# EasyEDA Pro project ProPrj_New Project_2026-07-15_23-14-34_2026-07-27.epro, schematic Schematic2
Board Name: Board1; Create Date: 2026-07-15; Page Name: P1; Project Name: New Project_2026-07-15_23-14-34; Schematic Name: Schematic1; Update Date: 2026-07-15; Company: EasyEDA.com; Page Size: A4; Version: V1.0
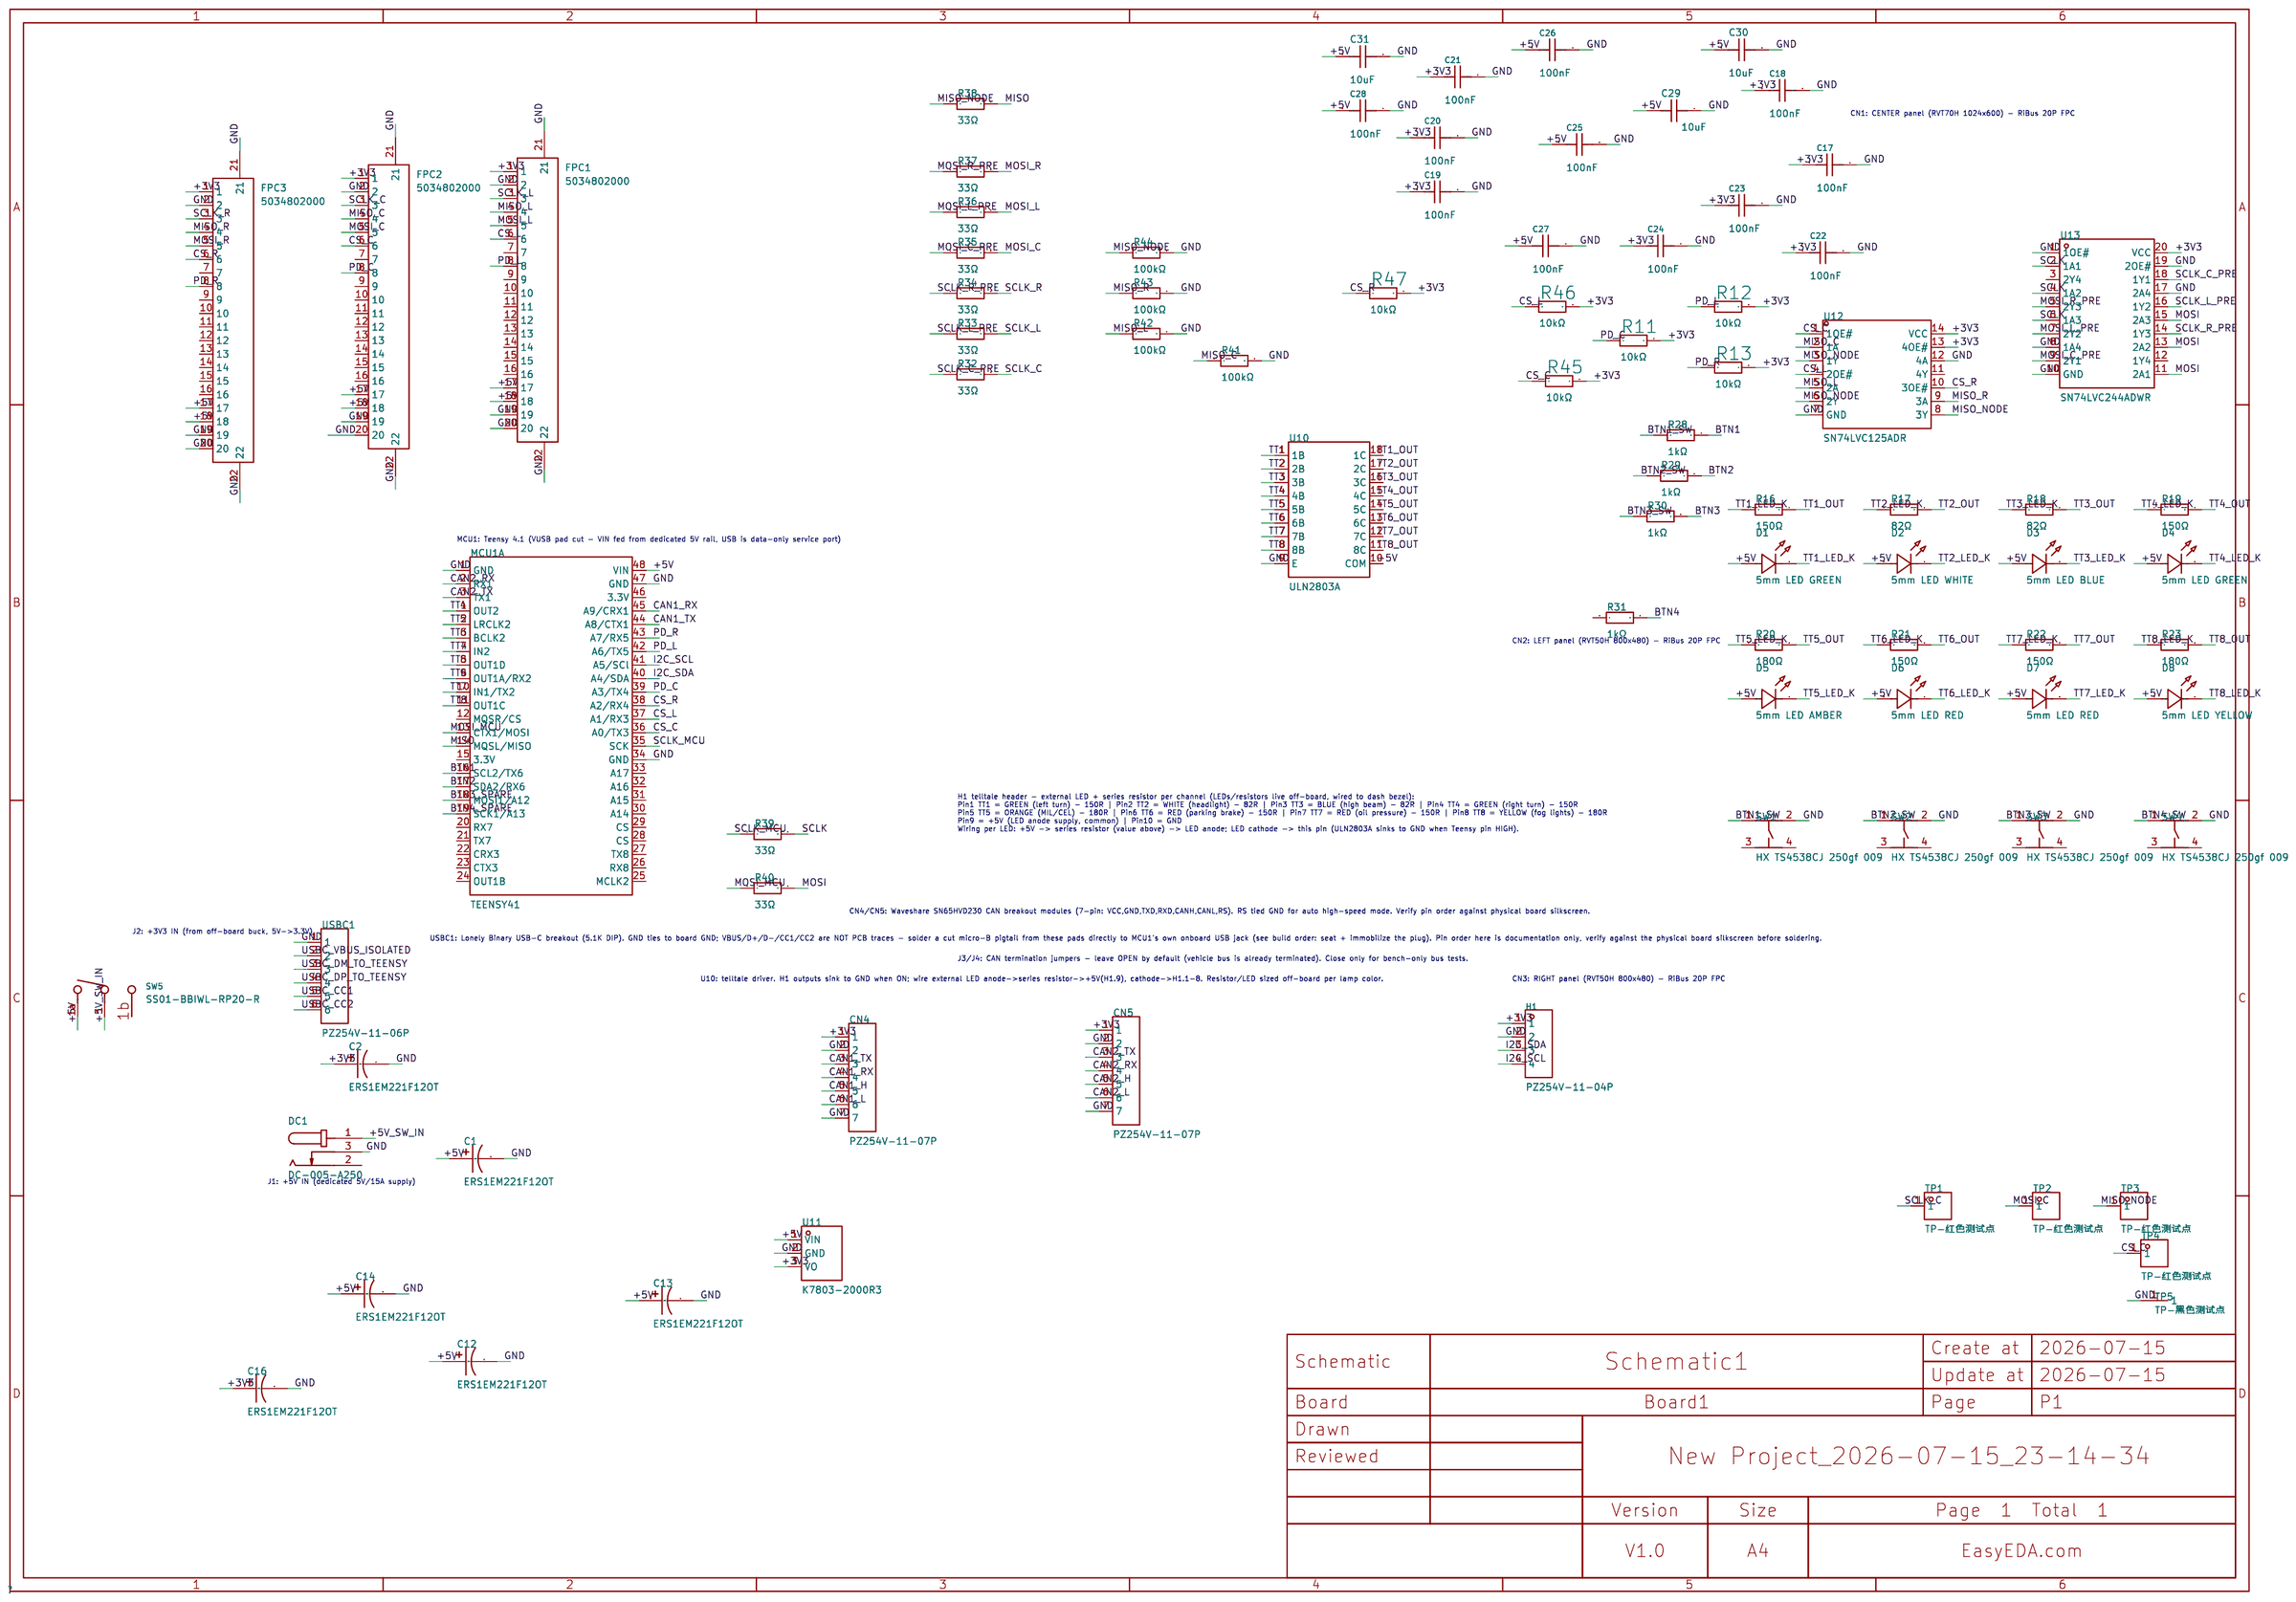
[diagram p1: schematic sheet]

## Parts
C1  220µF 25V  [CAP-TH_BD8.0-P3.50-D0.6-FD]
C2  220µF 25V  [CAP-TH_BD8.0-P3.50-D0.6-FD]
C12  220µF 25V  [CAP-TH_BD8.0-P3.50-D0.6-FD]
C13  220µF 25V  [CAP-TH_BD8.0-P3.50-D0.6-FD]
C14  220µF 25V  [CAP-TH_BD8.0-P3.50-D0.6-FD]
C16  220µF 25V  [CAP-TH_BD8.0-P3.50-D0.6-FD]
C17  100nF  [C0603]
C18  100nF  [C0603]
C19  100nF  [C0603]
C20  100nF  [C0603]
C21  100nF  [C0603]
C22  100nF  [C0603]
C23  100nF  [C0603]
C24  100nF  [C0603]
C25  100nF  [C0603]
C26  100nF  [C0603]
C27  100nF  [C0603]
C28  100nF  [C0603]
C29  10uF  [C0805]
C30  10uF  [C0805]
C31  10uF  [C0805]
CN4  1x7 header 2.54mm  [CONN-TH_7P-P2.54_C9900012194]
CN5  1x7 header 2.54mm  [CONN-TH_7P-P2.54_C9900012194]
D1  5mm LED GREEN  [LED-TH_BD5.0-P2.54-FD]
D2  5mm LED WHITE  [LED-TH_BD5.0-P2.54-FD]
D3  5mm LED BLUE  [LED-TH_BD5.0-P2.54-FD]
D4  5mm LED GREEN  [LED-TH_BD5.0-P2.54-FD]
D5  5mm LED AMBER  [LED-TH_BD5.0-P2.54-FD]
D6  5mm LED RED  [LED-TH_BD5.0-P2.54-FD]
D7  5mm LED RED  [LED-TH_BD5.0-P2.54-FD]
D8  5mm LED YELLOW  [LED-TH_BD5.0-P2.54-FD]
DC1  DC-005 5.5x2.5 5A  [DC-IN-TH_DC-005-2]
FPC1  RiBus LEFT panel  [FPC-SMD_5034802000]
FPC2  RiBus CENTER panel  [FPC-SMD_5034802000]
FPC3  RiBus RIGHT panel  [FPC-SMD_5034802000]
H1  PZ254V-11-04P  [HDR-TH_4P-P2.54-V-M]
MCU1  TEENSY41  [COMM-TH_L60.1-W17.8-P2.54]  (section 1)
R11  10kΩ  [R0603]
R12  10kΩ  [R0603]
R13  10kΩ  [R0603]
R16  150Ω  [R_AXIAL-0.4]
R17  82Ω  [R_AXIAL-0.4]
R18  82Ω  [R_AXIAL-0.4]
R19  150Ω  [R_AXIAL-0.4]
R20  180Ω  [R_AXIAL-0.4]
R21  150Ω  [R_AXIAL-0.4]
R22  150Ω  [R_AXIAL-0.4]
R23  180Ω  [R_AXIAL-0.4]
R28  1kΩ  [R0603]
R29  1kΩ  [R0603]
R30  1kΩ  [R0603]
R31  1kΩ  [R0603]
R32  33Ω  [R0603]
R33  33Ω  [R0603]
R34  33Ω  [R0603]
R35  33Ω  [R0603]
R36  33Ω  [R0603]
R37  33Ω  [R0603]
R38  33Ω  [R0603]
R39  33Ω  [R0603]
R40  33Ω  [R0603]
R41  100kΩ  [R0603]
R42  100kΩ  [R0603]
R43  100kΩ  [R0603]
R44  100kΩ  [R0603]
R45  10kΩ  [R0603]
R46  10kΩ  [R0603]
R47  10kΩ  [R0603]
SW1  tact 4.5x4.5 THT  [SW-TH_4P-L4.5-W4.5-P3.00-LS5.4]
SW2  tact 4.5x4.5 THT  [SW-TH_4P-L4.5-W4.5-P3.00-LS5.4]
SW3  tact 4.5x4.5 THT  [SW-TH_4P-L4.5-W4.5-P3.00-LS5.4]
SW4  tact 4.5x4.5 THT  [SW-TH_4P-L4.5-W4.5-P3.00-LS5.4]
SW5  SS01-BBIWL-RP20-R  [SW-TH_SS01-BBIWL-RP20-R]
TP1  TP SCLK_C  [TESTPOINT-TH_BD3.2]
TP2  TP MOSI_C  [TESTPOINT-TH_BD3.2]
TP3  TP MISO_NODE  [TESTPOINT-TH_BD3.2]
TP4  TP CS_C  [TESTPOINT-TH_BD3.2]
TP5  TP GND (scope ref)  [TESTPOINT-TH_BD3.2]
U10  ULN2803A  [SOIC-18_L11.6-W7.5-P1.27-LS10.3-BL]
U11  K7803-2000R3 3.3V 2A  [PWRM-TH_R-78EXX-1.0]
U12  SN74LVC125ADR  [SOIC-14_L8.7-W3.9-P1.27-LS6.0-BL]
U13  SN74LVC244ADWR  [SOIC-20_L13.0-W7.6-P1.27-LS10.3-BL]
USBC1  1x6 header 2.54mm  [HDR-TH_6P-P2.54-V-M_BLUE]

## Library data of the parts
C1 C2 C12-C14 C16 = Capacitor_THT:CP_Radial_D8.0mm_P2.50mm: Supplier Part: C160162; Manufacturer: AISHI(Aihua Group); Manufacturer Part: ERS1EM221F12OT; Supplier Footprint: 470uF_25V; JLCPCB Part Class: Extended Part; Supplier: LCSC
C17-C28 = CL10B104KB8NNNC: Capacitance:100nF Tolerance:±10% Tolerance:±10% Voltage Rating:50V Temperature Coefficient:X7R; LCSC Part Name: 100nF ±10% 50V; Supplier Part: C1591; Manufacturer: SAMSUNG(三星); Supplier Footprint: 0603; JLCPCB Part Class: Extended Part; Datasheet: https://item.szlcsc.com/datasheet/CL10B104KB8NNNC/1943.html; Supplier: LCSC; Tolerance: ±10%; Voltage Rating: 50V; Temperature Coefficient: X7R
C29-C31 = CL21A106KAYNNNE_C15850: Capacitance:10uF Tolerance:±10% Tolerance:±10% Voltage Rating:25V Temperature Coefficient:X5R; LCSC Part Name: 10uF ±10% 25V; Supplier Part: C15850; Manufacturer: SAMSUNG(三星); Manufacturer Part: CL21A106KAYNNNE; Supplier Footprint: 0805; JLCPCB Part Class: Basic Part; Datasheet: https://item.szlcsc.com/datasheet/CL21A106KAYNNNE/16532.html; Supplier: LCSC; Tolerance: ±10%; Voltage Rating: 25V; Temperature Coefficient: X5R
CN4 CN5 = 1*7pin排间距2.54mm: Supplier Part: C492406; Manufacturer: XFCN; Manufacturer Part: PZ254V-11-07P; Supplier Footprint: 插件; JLCPCB Part Class: Extended Part; Supplier: LCSC
D1-D8 = 5mm_LED: Supplier Part: C9900148483; Supplier Footprint: DIP; Supplier: LCSC
DC1 = DC-005-5.5*2.5: Supplier Part: C720558; Manufacturer: XUNPU; Manufacturer Part: DC-005-A250; Supplier Footprint: DC-005; JLCPCB Part Class: Extended Part; Supplier: LCSC
FPC1-FPC3 = 5034802000: Locking Feature:Hinged Lid Contact Type:Double-Sided Contacts, Top and Bottom Entry Number of Contacts:20P Pitch:0.5mm Mounting Type:Surface Mount, Right Angle FFC, FCB Thickness:0.3mm FFC, FCB Thickness:0.3mm Height Above Board:1mm Contact Material:Phosp; LCSC Part Name: 翻盖式 双侧触点/上下接 P数:20P 间距:0.5mm; Supplier Part: C234192; Manufacturer: MOLEX; Supplier Footprint: SMD,P=0.5mm,卧贴; JLCPCB Part Class: Extended Part; Datasheet: https://www.molex.com/content/dam/molex/molex-dot-com/products/automated/en-us/salesdrawingpdf/503/503480/5034802000_sd.pdf?inline; Supplier: LCSC; Locking Feature: Hinged Lid; Contact Type: Double-Sided Contacts, Top and Bottom Entry; Number of Contacts: 20P; Pitch: 0.5mm; Mounting Type: Surface Mount, Right Angle; FFC, FCB Thickness: 0.3mm; Height Above Board: 1mm; Contact Material: Phosphor bronze; Contact Plating: Gold; Operating Temperature: -40℃~+85℃; Rated Voltage (Max): 50V; Current Rating (Max): 500mA
H1 = PZ254V-11-04P: Pin Structure:1x4P Pitch:2.54mm Row Spacing:- Circluar Pins/Square Pins:Pin Header Mounting Type:Through Hole Number of Rows:1 Number of Pins:4P Current Rating:3A Voltage Rating (Max):250V Length of Mating Pin:6mm Insulation Height:2.5mm Length of End Con; LCSC Part Name: 1x4P 间距:2.54mm 方针 直插; Supplier Part: C2691448; Manufacturer: XFCN(兴飞); Supplier Footprint: 插件,P=2.54mm; JLCPCB Part Class: Extended Part; Datasheet: https://item.szlcsc.com/datasheet/PZ254V-11-04P/2801085.html; Supplier: LCSC; Pin Structure: 1x4P; Pitch: 2.54mm; Circluar Pins/Square Pins: Pin Header; Mounting Type: Through Hole; Number of Rows: 1; Number of Pins: 4P; Current Rating: 3A; Voltage Rating (Max): 250V; Length of Mating Pin: 6mm; Insulation Height: 2.5mm; Length of End Connection Pin: 3mm; Operating Temperature: -40℃~+105℃; Color: Black
MCU1 = TEENSY41: Supplier Part: C9900133442; Supplier Footprint: SMD; Supplier: LCSC
R11-R13 R45-R47 = 0603WAF1002T5E: Type:Thick Film Resistor Resistance:10kΩ Tolerance:±1% Tolerance:±1% Power(Watts):100mW Voltage-Supply(Max):75V Temperature Coefficient:±100ppm/℃ Temperature Coefficient:±100ppm/℃ Operating Temperature:-55℃~+155℃ Operating Temperature:-55℃~+155℃; LCSC Part Name: 厚膜电阻 10kΩ ±1% 100mW; Supplier Part: C98220; Manufacturer: YAGEO; Manufacturer Part: RC0603FR-0710KL; Supplier Footprint: 0603; JLCPCB Part Class: Basic Part; Datasheet: https://item.szlcsc.com/datasheet/0603WAF1002T5E/26547.html; Supplier: LCSC; Type: Thick Film Resistor; Tolerance: ±1%; Power(Watts): 100mW; Voltage-Supply(Max): 75V; Temperature Coefficient: ±100ppm/℃; Operating Temperature: -55℃~+155℃
R16 R19 R21 R22 = Res_AXIAL-1/4W: Supplier Footprint: Through; Manufacturer: VO; Manufacturer Part: MF1/4W-150Ω±1%-ST52; Supplier: LCSC; Supplier Part: C2903242
R17 R18 = Res_AXIAL-1/4W: Supplier Footprint: Through; Manufacturer: CCO(Chian Chia Elec); Manufacturer Part: MF1/4W-82Ω±1% T; Supplier: LCSC; Supplier Part: C119302
R20 R23 = Res_AXIAL-1/4W: Supplier Footprint: Through; Manufacturer: CCO(Chian Chia Elec); Manufacturer Part: MF1/4W-180Ω±1% T; Supplier: LCSC; Supplier Part: C119308
R28-R31 = 0603WAF1001T5E: Type:Thick Film Resistor Resistance:1kΩ Tolerance:±1% Tolerance:±1% Power(Watts):100mW Voltage-Supply(Max):75V Temperature Coefficient:±100ppm/℃ Temperature Coefficient:±100ppm/℃ Operating Temperature:-55℃~+155℃ Operating Temperature:-55℃~+155℃; LCSC Part Name: 1kΩ ±1% 100mW 厚膜电阻; Supplier Part: C21190; Manufacturer: UNI-ROYAL(厚声); Supplier Footprint: 0603; JLCPCB Part Class: Basic Part; Datasheet: https://item.szlcsc.com/datasheet/0603WAF1001T5E/21904.html; Supplier: LCSC; Type: Thick Film Resistor; Tolerance: ±1%; Power(Watts): 100mW; Voltage-Supply(Max): 75V; Temperature Coefficient: ±100ppm/℃; Operating Temperature: -55℃~+155℃
R32-R40 = 0603WAF330JT5E: Type:Thick Film Resistor Resistance:33Ω Tolerance:±1% Tolerance:±1% Power(Watts):100mW Voltage-Supply(Max):75V Temperature Coefficient:±100ppm/℃ Temperature Coefficient:±100ppm/℃ Operating Temperature:-55℃~+155℃ Operating Temperature:-55℃~+155℃; LCSC Part Name: 33Ω ±1% 100mW 厚膜电阻; Supplier Part: C23140; Manufacturer: UNI-ROYAL(厚声); Supplier Footprint: 0603; JLCPCB Part Class: Basic Part; Datasheet: https://item.szlcsc.com/datasheet/0603WAF330JT5E/23867.html; Supplier: LCSC; Type: Thick Film Resistor; Tolerance: ±1%; Power(Watts): 100mW; Voltage-Supply(Max): 75V; Temperature Coefficient: ±100ppm/℃; Operating Temperature: -55℃~+155℃
R41-R44 = 0603WAF1003T5E: Type:Thick Film Resistor Resistance:100kΩ Tolerance:±1% Tolerance:±1% Power(Watts):100mW Voltage-Supply(Max):75V Temperature Coefficient:±100ppm/℃ Temperature Coefficient:±100ppm/℃ Operating Temperature:-55℃~+155℃ Operating Temperature:-55℃~+155℃; LCSC Part Name: 100kΩ ±1% 100mW 厚膜电阻; Supplier Part: C25803; Manufacturer: UNI-ROYAL(厚声); Supplier Footprint: 0603; JLCPCB Part Class: Basic Part; Datasheet: https://item.szlcsc.com/datasheet/0603WAF1003T5E/26546.html; Supplier: LCSC; Type: Thick Film Resistor; Tolerance: ±1%; Power(Watts): 100mW; Voltage-Supply(Max): 75V; Temperature Coefficient: ±100ppm/℃; Operating Temperature: -55℃~+155℃
SW1-SW4 = 4.5x4.5x4.5Waterproof Tact Switch DIP 260g: LCSC Part Name: 4.5x4.5x4.5防水插件轻触开关260g; Supplier Part: C5340169; Manufacturer: hanxia; Manufacturer Part: HX TS4538CJ 250gf 009; Supplier Footprint: DIP-4P,4.5x4.5mm; Datasheet: https://atta.szlcsc.com/upload/public/pdf/source/20240809/87BC5FA876BA79D376E205D58434F11F.pdf; Supplier: LCSC
SW5 = SS01-BBIWL-RP20-R: Length:13.3mm Width:8.5mm Actuator Type:Concave Bend With Lamp:No Termination Style:PC Pin Actuator Color:Black Current Rating:16A Voltage Rating (AC):250V Circuit:SPST Life:- Operating Temperature:-40℃~+125℃ Operating Temperature:-40℃~+125℃ Actuator Iden; LCSC Part Name: 跷板开关SPST 8.5x13.3mm; Supplier Part: C309064; Manufacturer: Legion(六钧); Supplier Footprint: 插件,13.3x8.5mm; JLCPCB Part Class: Extended Part; Datasheet: https://item.szlcsc.com/datasheet/SS01-BBIWL-RP20-R/292825.html; Supplier: LCSC; Length: 13.3mm; Width: 8.5mm; Actuator Type: Concave Bend; With Lamp: No; Termination Style: PC Pin; Actuator Color: Black; Current Rating: 16A; Voltage Rating (AC): 250V; Circuit: SPST; Operating Temperature: -40℃~+125℃; Actuator Identifier: - O
TP1-TP4 = TP-红色测试点: Supplier Part: C9900007423; Supplier Footprint: TESTPOINT-TH_BD-2P-P2.00; JLCPCB Part Class: Extended Part; Supplier: LCSC
TP5 = TP-黑色测试点: Supplier Part: C9900007426; Supplier Footprint: TESTPOINT-TH_BD-2P-P2.00; JLCPCB Part Class: Extended Part; Supplier: LCSC
U10 = ULN2803A_C181731: number of channels:8 Collector - Emitter Voltage VCEO:50V Current - Collector(Ic):500mA Voltage - Input(Max):30V Operating Temperature:-40℃~+85℃ Operating Temperature:-40℃~+85℃ Output Leakage Current(Icex):50uA Input Current(on):4mA Voltage - Forward(Vf):; LCSC Part Name: 八路高耐压大电流达林顿晶体管阵列; Supplier Part: C181731; Manufacturer: Mixic(中科芯亿达); Supplier Footprint: SOP-18-300mil; JLCPCB Part Class: Extended Part; Datasheet: https://item.szlcsc.com/datasheet/ULN2803A/193128.html; Supplier: LCSC; number of channels: 8; Collector - Emitter Voltage VCEO: 50V; Current - Collector(Ic): 500mA; Voltage - Input(Max): 30V; Operating Temperature: -40℃~+85℃; Output Leakage Current(Icex): 50uA; Input Current(on): 4mA; Voltage - Forward(Vf): 1.6V; Input Capacitiance(Ci): 15pF
U11 = R-78E3.3-1.0: Type:- Function:Step-down type Number of Outputs:1 Voltage - Supply:6V~36V Voltage - Supply:6V~36V Conversion Efficiency:90% Conversion Efficiency:90% Output Voltage:3.3V Output Voltage:3.3V Output Voltage Accuracy:±3% Output Voltage Accuracy:±3% Output C; LCSC Part Name: DC/DC电源模块宽压输入非隔离稳压输出; Supplier Part: C48888166; Manufacturer: rlt; Manufacturer Part: K7803-2000R3; Supplier Footprint: SIP,11.6x7.5mm; JLCPCB Part Class: Extended Part; Datasheet: https://item.szlcsc.com/datasheet/R-78E3.3-1.0/23862551.html; Supplier: LCSC; Function: Step-down type; Number of Outputs: 1; Voltage - Supply: 6V~36V; Conversion Efficiency: 90%; Output Voltage: 3.3V; Output Voltage Accuracy: ±3%; Output Current(Max): 1A; Quiescent Supply Current: 300uA; Ripple Noise: 50mVp-p; Switching Frequency: 850kHz; Capacitive Load(Max): 2200uF; Operating Temperature Range: -40℃~+85℃; Length: 11.6mm; Width: 7.5mm; Height: 10.2mm; Features: Short Circuit Protection；Automatic fault recovery
U12 = SN74LVC125ADR: Input type:- output type:Tri-State Voltage - Supply:1.65V~3.6V Voltage - Supply:1.65V~3.6V Number of Elements:4 Number of Bits per Element:1 Channel Type:Unidirectional Current - Output Low(IOL):24mA Current - Output High(IOH):24mA Logic Family:74LVC Oper; LCSC Part Name: 三态输出，四路总线缓冲门; Supplier Part: C7661; Manufacturer: TI(德州仪器); Supplier Footprint: SOIC-14; JLCPCB Part Class: Extended Part; Datasheet: https://www.ti.com/cn/lit/gpn/sn74lvc125a; Supplier: LCSC; output type: Tri-State; Voltage - Supply: 1.65V~3.6V; Number of Elements: 4; Number of Bits per Element: 1; Channel Type: Unidirectional; Current - Output Low(IOL): 24mA; Current - Output High(IOH): 24mA; Logic Family: 74LVC; Operating Temperature: -40℃~+125℃; Quiescent Current: 40uA; Propagation Delay: 2.5ns@3.3V,50pF
U13 = SN74LVC244ADWR: Input type:- output type:Tri-State Voltage - Supply:1.65V~3.6V Voltage - Supply:1.65V~3.6V Number of Elements:2 Number of Bits per Element:4 Channel Type:Unidirectional Current - Output Low(IOL):24mA Current - Output High(IOH):24mA Logic Family:74LVC Oper; LCSC Part Name: 三态输出，八路缓冲器或驱动器; Supplier Part: C507250; Manufacturer: TI(德州仪器); Supplier Footprint: SOIC-20-300mil; JLCPCB Part Class: Extended Part; Datasheet: https://www.ti.com/cn/lit/gpn/sn74lvc244a; Supplier: LCSC; output type: Tri-State; Voltage - Supply: 1.65V~3.6V; Number of Elements: 2; Number of Bits per Element: 4; Channel Type: Unidirectional; Current - Output Low(IOL): 24mA; Current - Output High(IOH): 24mA; Logic Family: 74LVC; Operating Temperature: -40℃~+125℃; Quiescent Current: 40uA; Propagation Delay: 3.9ns@3.3V,50pF
USBC1 = 2.54-1*6-BLUE: Supplier Part: C492405; Manufacturer: XFCN; Manufacturer Part: PZ254V-11-06P; Supplier Footprint: 排针插件,P=2.54mm-蓝色; JLCPCB Part Class: Extended Part; Supplier: LCSC

## Nets
+3V3: C2.1 C16.1 C17.1 C18.1 C19.1 C20.1 C21.1 C22.1 C23.1 C24.1 CN4.1 CN5.1 FPC1.1 FPC2.1 FPC3.1 H1.1 R11.2 R12.2 R13.2 R45.2 R46.2 R47.2 U11.3(VO) U12.13(4OE#) U12.14(VCC) U13.20(VCC)
+5V: C1.1 C12.1 C13.1 C14.1 C25.1 C26.1 C27.1 C28.1 C29.1 C30.1 C31.1 D1.1(A) D2.1(A) D3.1(A) D4.1(A) D5.1(A) D6.1(A) D7.1(A) D8.1(A) FPC1.17 FPC1.18 FPC2.17 FPC2.18 FPC3.17 FPC3.18 MCU1.48(VIN) SW5.1a U10.10(COM) U11.1(VIN)
+5V_SW_IN: DC1.1 SW5.1
GND: C1.2 C2.2 C12.2 C13.2 C14.2 C16.2 C17.2 C18.2 C19.2 C20.2 C21.2 C22.2 C23.2 C24.2 C25.2 C26.2 C27.2 C28.2 C29.2 C30.2 C31.2 CN4.2 CN4.7 CN5.2 CN5.7 DC1.3 FPC1.2 FPC1.19 FPC1.20 FPC1.21 FPC1.22 FPC2.2 FPC2.19 FPC2.20 FPC2.21 FPC2.22 FPC3.2 FPC3.19 FPC3.20 FPC3.21 FPC3.22 H1.2 MCU1.1(GND) MCU1.34(GND) MCU1.47(GND) R41.2 R42.2 R43.2 R44.2 SW1.2 SW2.2 SW3.2 SW4.2 TP5.1 U10.9(E) U11.2(GND) U12.7(GND) U12.12(4A) U13.1(1OE#) U13.8(1A4) U13.10(GND) U13.17(2A4) U13.19(2OE#) USBC1.1
BTN1: MCU1.16(SCL2/TX6) R28.2
BTN1_SW: R28.1 SW1.1
BTN2: MCU1.17(SDA2/RX6) R29.2
BTN2_SW: R29.1 SW2.1
BTN3: R30.2
BTN3_SPARE: MCU1.18(MOSI1/A12)
BTN3_SW: R30.1 SW3.1
BTN4: R31.2
BTN4_SPARE: MCU1.19(SCK1/A13)
BTN4_SW: SW4.1
CAN1_H: CN4.5
CAN1_L: CN4.6
CAN1_RX: CN4.4 MCU1.45(A9/CRX1)
CAN1_TX: CN4.3 MCU1.44(A8/CTX1)
CAN2_H: CN5.5
CAN2_L: CN5.6
CAN2_RX: CN5.4 MCU1.2(RX1)
CAN2_TX: CN5.3 MCU1.3(TX1)
CS_C: FPC2.6 MCU1.36(A0/TX3) R45.1 TP4.1 U12.1(1OE#)
CS_L: FPC1.6 MCU1.37(A1/RX3) R46.1 U12.4(2OE#)
CS_R: FPC3.6 MCU1.38(A2/RX4) R47.1 U12.10(3OE#)
I2C_SCL: H1.4 MCU1.41(A5/SCl)
I2C_SDA: H1.3 MCU1.40(A4/SDA)
MISO: MCU1.14(MQSL/MISO) R38.2
MISO_C: FPC2.4 R41.1 U12.2(1A)
MISO_L: FPC1.4 R42.1 U12.5(2A)
MISO_NODE: R38.1 R44.1 TP3.1 U12.3(1Y) U12.6(2Y) U12.8(3Y)
MISO_R: FPC3.4 R43.1 U12.9(3A)
MOSI: R40.2 U13.11(2A1) U13.13(2A2) U13.15(2A3)
MOSI_C: FPC2.5 R35.2 TP2.1
MOSI_C_PRE: R35.1 U13.9(2Y1)
MOSI_L: FPC1.5 R36.2
MOSI_L_PRE: R36.1 U13.7(2Y2)
MOSI_MCU: MCU1.13(CTX1/MOSI) R40.1
MOSI_R: FPC3.5 R37.2
MOSI_R_PRE: R37.1 U13.5(2Y3)
PD_C: FPC2.8 MCU1.39(A3/TX4) R11.1
PD_L: FPC1.8 MCU1.42(A6/TX5) R12.1
PD_R: FPC3.8 MCU1.43(A7/RX5) R13.1
SCLK: R39.2 U13.2(1A1) U13.4(1A2) U13.6(1A3)
SCLK_C: FPC2.3 R32.2 TP1.1
SCLK_C_PRE: R32.1 U13.18(1Y1)
SCLK_L: FPC1.3 R33.2
SCLK_L_PRE: R33.1 U13.16(1Y2)
SCLK_MCU: MCU1.35(SCK) R39.1
SCLK_R: FPC3.3 R34.2
SCLK_R_PRE: R34.1 U13.14(1Y3)
TT1: MCU1.4(OUT2) U10.1(1B)
TT1_LED_K: D1.2(K) R16.1
TT1_OUT: R16.2 U10.18(1C)
TT2: MCU1.5(LRCLK2) U10.2(2B)
TT2_LED_K: D2.2(K) R17.1
TT2_OUT: R17.2 U10.17(2C)
TT3: MCU1.6(BCLK2) U10.3(3B)
TT3_LED_K: D3.2(K) R18.1
TT3_OUT: R18.2 U10.16(3C)
TT4: MCU1.7(IN2) U10.4(4B)
TT4_LED_K: D4.2(K) R19.1
TT4_OUT: R19.2 U10.15(4C)
TT5: MCU1.8(OUT1D) U10.5(5B)
TT5_LED_K: D5.2(K) R20.1
TT5_OUT: R20.2 U10.14(5C)
TT6: MCU1.9(OUT1A/RX2) U10.6(6B)
TT6_LED_K: D6.2(K) R21.1
TT6_OUT: R21.2 U10.13(6C)
TT7: MCU1.10(IN1/TX2) U10.7(7B)
TT7_LED_K: D7.2(K) R22.1
TT7_OUT: R22.2 U10.12(7C)
TT8: MCU1.11(OUT1C) U10.8(8B)
TT8_LED_K: D8.2(K) R23.1
TT8_OUT: R23.2 U10.11(8C)
USBC_CC1: USBC1.5
USBC_CC2: USBC1.6
USBC_DM_TO_TEENSY: USBC1.3
USBC_DP_TO_TEENSY: USBC1.4
USBC_VBUS_ISOLATED: USBC1.2

Not connected (* = marked no-connect by the designer): DC1 2; FPC1 7 9 10 11 12 13 14 15 16; FPC2 7 9 10 11 12 13 14 15 16; FPC3 7 9 10 11 12 13 14 15 16; MCU1 12(MQSR/CS) 15(3.3V) 20(RX7) 21(TX7) 22(CRX3) 23(CTX3) 24(OUT1B) 25(MCLK2) 26(RX8) 27(TX8) 28(CS) 29(CS) 30(A14) 31(A15) 32(A16) 33(A17) 46(3.3V); R31 1; SW1 3 4; SW2 3 4; SW3 3 4; SW4 3 4; U12 11(4Y); U13 3(2Y4) 12(1Y4)

## Notes on the sheet
- CN1: CENTER panel (RVT70H 1024x600) - RiBus 20P FPC
- MCU1: Teensy 4.1 (VUSB pad cut - VIN fed from dedicated 5V rail, USB is data-only service port)
- CN2: LEFT panel (RVT50H 800x480) - RiBus 20P FPC
- H1 telltale header - external LED + series resistor per channel (LEDs/resistors live off-board, wired to dash bezel):
  Pin1 TT1 = GREEN (left turn) - 150R | Pin2 TT2 = WHITE (headlight) - 82R | Pin3 TT3 = BLUE (high beam) - 82R | Pin4 TT4 = GREEN (right turn) - 150R
  Pin5 TT5 = ORANGE (MIL/CEL) - 180R | Pin6 TT6 = RED (parking brake) - 150R | Pin7 TT7 = RED (oil pressure) - 150R | Pin8 TT8 = YELLOW (fog lights) - 180R
  Pin9 = +5V (LED anode supply, common) | Pin10 = GND
  Wiring per LED: +5V -> series resistor (value above) -> LED anode; LED cathode -> this pin (ULN2803A sinks to GND when Teensy pin HIGH).
- CN4/CN5: Waveshare SN65HVD230 CAN breakout modules (7-pin: VCC,GND,TXD,RXD,CANH,CANL,RS). RS tied GND for auto high-speed mode. Verify pin order against physical board silkscreen.
- J2: +3V3 IN (from off-board buck, 5V->3.3V)
- USBC1: Lonely Binary USB-C breakout (5.1K DIP). GND ties to board GND; VBUS/D+/D-/CC1/CC2 are NOT PCB traces - solder a cut micro-B pigtail from these pads directly to MCU1's own onboard USB jack (see build order: seat + immobilize the plug). Pin order here is documentation only, verify against the physical board silkscreen before soldering.
- J3/J4: CAN termination jumpers - leave OPEN by default (vehicle bus is already terminated). Close only for bench-only bus tests.
- U10: telltale driver. H1 outputs sink to GND when ON; wire external LED anode->series resistor->+5V(H1.9), cathode->H1.1-8. Resistor/LED sized off-board per lamp color.
- CN3: RIGHT panel (RVT50H 800x480) - RiBus 20P FPC
- J1: +5V IN (dedicated 5V/15A supply)
